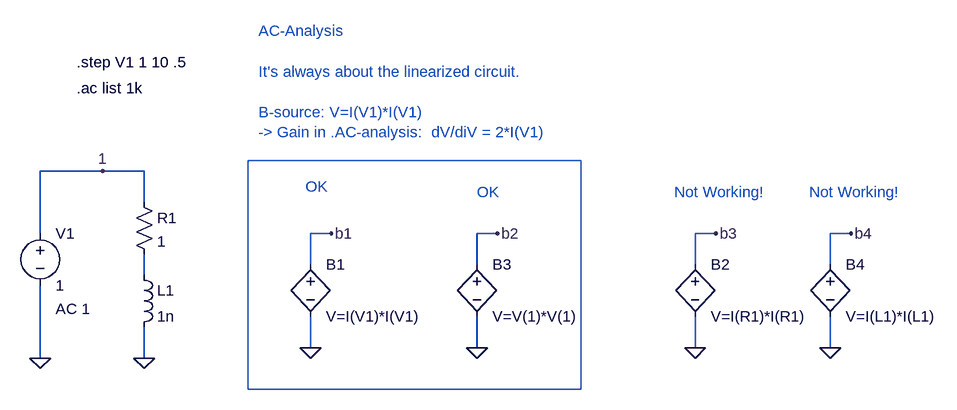
[diagram p0: schematic B_sources_AC1.asc]
B_sources_AC1.asc, the LTspice schematic file:
Version 4
SHEET 1 1176 680
WIRE -128 64 -224 64
WIRE -64 64 -128 64
WIRE -64 112 -64 64
WIRE -224 160 -224 64
WIRE 224 160 192 160
WIRE 480 160 448 160
WIRE 816 160 784 160
WIRE 1024 160 992 160
WIRE 192 208 192 160
WIRE 448 208 448 160
WIRE 784 208 784 160
WIRE 992 208 992 160
WIRE -64 224 -64 192
WIRE 192 336 192 288
WIRE 448 336 448 288
WIRE 784 336 784 288
WIRE 992 336 992 288
WIRE -224 352 -224 240
WIRE -64 352 -64 304
FLAG -64 352 0
FLAG -224 352 0
FLAG 192 336 0
FLAG -128 64 1
FLAG 224 160 b1
FLAG 784 336 0
FLAG 816 160 b3
FLAG 448 336 0
FLAG 480 160 b2
FLAG 992 336 0
FLAG 1024 160 b4
SYMBOL bv 192 192 R0
SYMATTR InstName B1
SYMATTR Value V=I(V1)*I(V1)
SYMBOL voltage -224 144 R0
WINDOW 123 24 132 Left 0
WINDOW 39 0 0 Left 0
SYMATTR InstName V1
SYMATTR Value 1
SYMATTR Value2 AC 1
SYMBOL res -80 96 R0
SYMATTR InstName R1
SYMATTR Value 1
SYMBOL bv 784 192 R0
SYMATTR InstName B2
SYMATTR Value V=I(R1)*I(R1)
SYMBOL bv 448 192 R0
SYMATTR InstName B3
SYMATTR Value V=V(1)*V(1)
SYMBOL ind -80 208 R0
SYMATTR InstName L1
SYMATTR Value 1n
SYMBOL bv 992 192 R0
SYMATTR InstName B4
SYMATTR Value V=I(L1)*I(L1)
TEXT -168 -64 Left 0 !.ac list 1k
TEXT -168 -104 Left 0 !.step V1 1 10 .5
TEXT 184 88 Left 0 ;OK
TEXT 752 96 Left 0 ;Not Working!
TEXT 112 -152 Left 0 ;AC-Analysis\n \nIt's always about the linearized circuit.\n \nB-source: V=I(V1)*I(V1)\n-> Gain in .AC-analysis:  dV/diV = 2*I(V1)
TEXT 448 96 Left 0 ;OK
TEXT 960 96 Left 0 ;Not Working!
RECTANGLE Normal 608 400 96 48

The netlist it stands for:
* B_sources_AC1.asc
B1 b1 0 V=I(V1)*I(V1)
V1 1 0 1 AC 1
R1 1 N001 1
B2 b3 0 V=I(R1)*I(R1)
B3 b2 0 V=V(1)*V(1)
L1 N001 0 1n
B4 b4 0 V=I(L1)*I(L1)
.ac list 1k
.step V1 1 10 .5
* OK
* Not Working!
* AC-Analysis
* It's always about the linearized circuit.
* B-source: V=I(V1)*I(V1)
* -> Gain in .AC-analysis:  dV/diV = 2*I(V1)
* OK
* Not Working!
.backanno
.end